# Altium schematic sheet LB-word-decoder.SchDoc
size A4
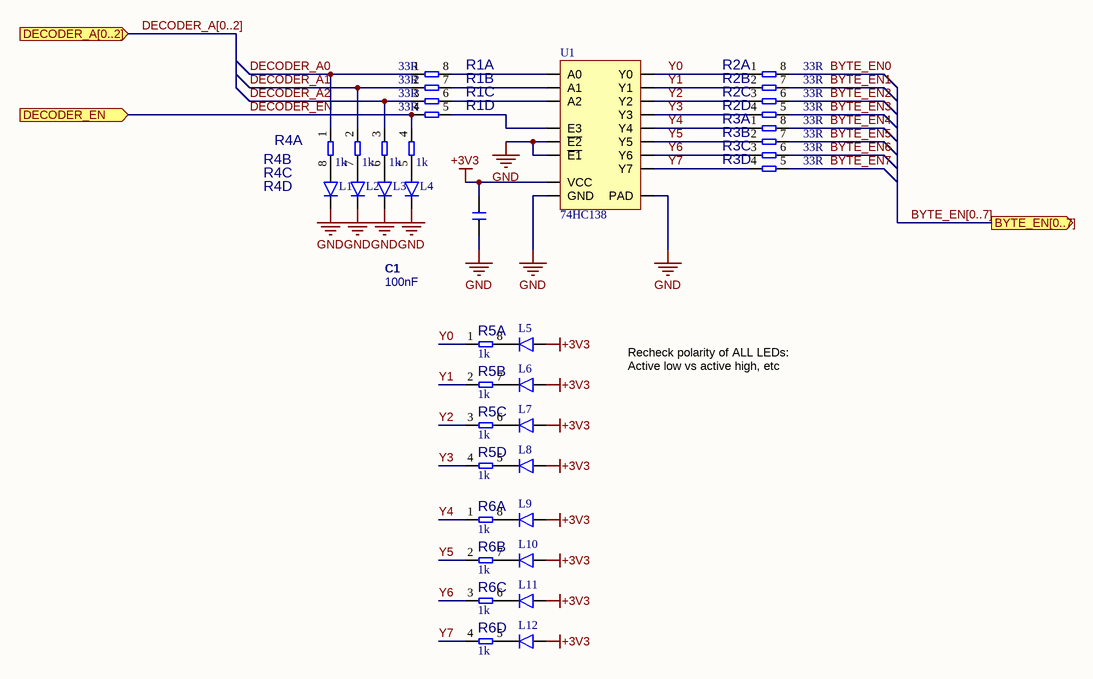
[diagram p0: LB-word-decoder.SchDoc]

## Parts
C1  100nF  [C0603_N]
L1  LED  [LED 0603/1608]  (value not drawn)
L2  LED  [LED 0603/1608]  (value not drawn)
L3  LED  [LED 0603/1608]  (value not drawn)
L4  LED  [LED 0603/1608]  (value not drawn)
L5  LED  [LED 0603/1608]  (value not drawn)
L6  LED  [LED 0603/1608]  (value not drawn)
L7  LED  [LED 0603/1608]  (value not drawn)
L8  LED  [LED 0603/1608]  (value not drawn)
L9  LED  [LED 0603/1608]  (value not drawn)
L10  LED  [LED 0603/1608]  (value not drawn)
L11  LED  [LED 0603/1608]  (value not drawn)
L12  LED  [LED 0603/1608]  (value not drawn)
R1  value 33R  [YC164]  (parts A,B,C,D of 4)
R2  value 33R  [YC164]  (parts A,B,C,D of 4)
R3  value 33R  [YC164]  (parts A,B,C,D of 4)
R4  value 1k  [YC164]  (parts A,B,C,D of 4)
R5  value 1k  [YC164]  (parts A,B,C,D of 4)
R6  value 1k  [YC164]  (parts A,B,C,D of 4)
U1  74HC138  [DHVQFN16]

## Ports
BYTE_EN[0..7] (out), DECODER_A[0..2] (in), DECODER_EN (in)

## Nets
+3V3: C1.1 L5.2(A) L6.2(A) L7.2(A) L8.2(A) L9.2(A) L10.2(A) L11.2(A) L12.2(A) U1.16(VCC)
GND: C1.2 L1.1(K) L2.1(K) L3.1(K) L4.1(K) U1.4(~{E1}) U1.5(~{E2}) U1.8(GND) U1.PAD
BYTE_EN0: R2.8
BYTE_EN1: R2.7
BYTE_EN2: R2.6
BYTE_EN3: R2.5
BYTE_EN4: R3.8
BYTE_EN5: R3.7
BYTE_EN6: R3.6
BYTE_EN7: R3.5
DECODER_A0: R1.1 R4.1
DECODER_A1: R1.2 R4.2
DECODER_A2: R1.3 R4.3
DECODER_EN: R1.4 R4.4 ; port DECODER_EN
Y0: R2.1 R5.1 U1.15(Y0)
Y1: R2.2 R5.2 U1.14(Y1)
Y2: R2.3 R5.3 U1.13(Y2)
Y3: R2.4 R5.4 U1.12(Y3)
Y4: R3.1 R6.1 U1.11(Y4)
Y5: R3.2 R6.2 U1.10(Y5)
Y6: R3.3 R6.3 U1.9(Y6)
Y7: R3.4 R6.4 U1.7(Y7)
NetL1_2: L1.2(A) R4.8
NetL2_2: L2.2(A) R4.7
NetL3_2: L3.2(A) R4.6
NetL4_2: L4.2(A) R4.5
NetL5_1: L5.1(K) R5.8
NetL6_1: L6.1(K) R5.7
NetL7_1: L7.1(K) R5.6
NetL8_1: L8.1(K) R5.5
NetL9_1: L9.1(K) R6.8
NetL10_1: L10.1(K) R6.7
NetL11_1: L11.1(K) R6.6
NetL12_1: L12.1(K) R6.5
NetR1_5: R1.5 U1.6(E3)
NetR1_6: R1.6 U1.3(A2)
NetR1_7: R1.7 U1.2(A1)
NetR1_8: R1.8 U1.1(A0)

## Buses and harness runs
bus BYTE_EN[0..7] = port BYTE_EN[0..7]
bus DECODER_A[0..2] = port DECODER_A[0..2]

## Notes on the sheet
- Recheck polarity of ALL LEDs:
  Active low vs active high, etc

## Library data of the parts
C1 = Capacitor: Capacitor MLCC; Manufacturer: Yageo; Manufacturer Part Number: CC0603KRX7R9BB104; Tolerance (%): 10; Category: Capacitor; Package: 0603; Value: 100nF; Supplier Part Number 1: 1362556; Supplier 1: Farnell; ComponentLink1URL: http://www.yageo.com; ComponentLink1Description: Manufacturer Website; Voltage Rating (Volts): *; Supplier 2: Digi-Key; Supplier Part Number 2: 311-1344-1-ND
R1-R6 = Resistor Array - 4P
U1 = 74HC138: 3 to 8 Decoder